# Altium schematic sheet EGT_V1.SchDoc
size B; PageSetup: Record=PageOptions|CenterHorizontal=True|CenterVertical=True|PrintScale=1.00|XCorrection=1.00|YCorrection=1.00|PrintKind=1|BorderSize=5000000|LeftOffset=0|BottomOffset=0|Orientation=2|PaperLength=1000|PaperWidth=1000|Scale=100|PaperSource=7|PrintQuality=-3|MediaType=1|DitherType=10|PrintScaleMode=1|PaperKind=Letter|PaperIndex=1
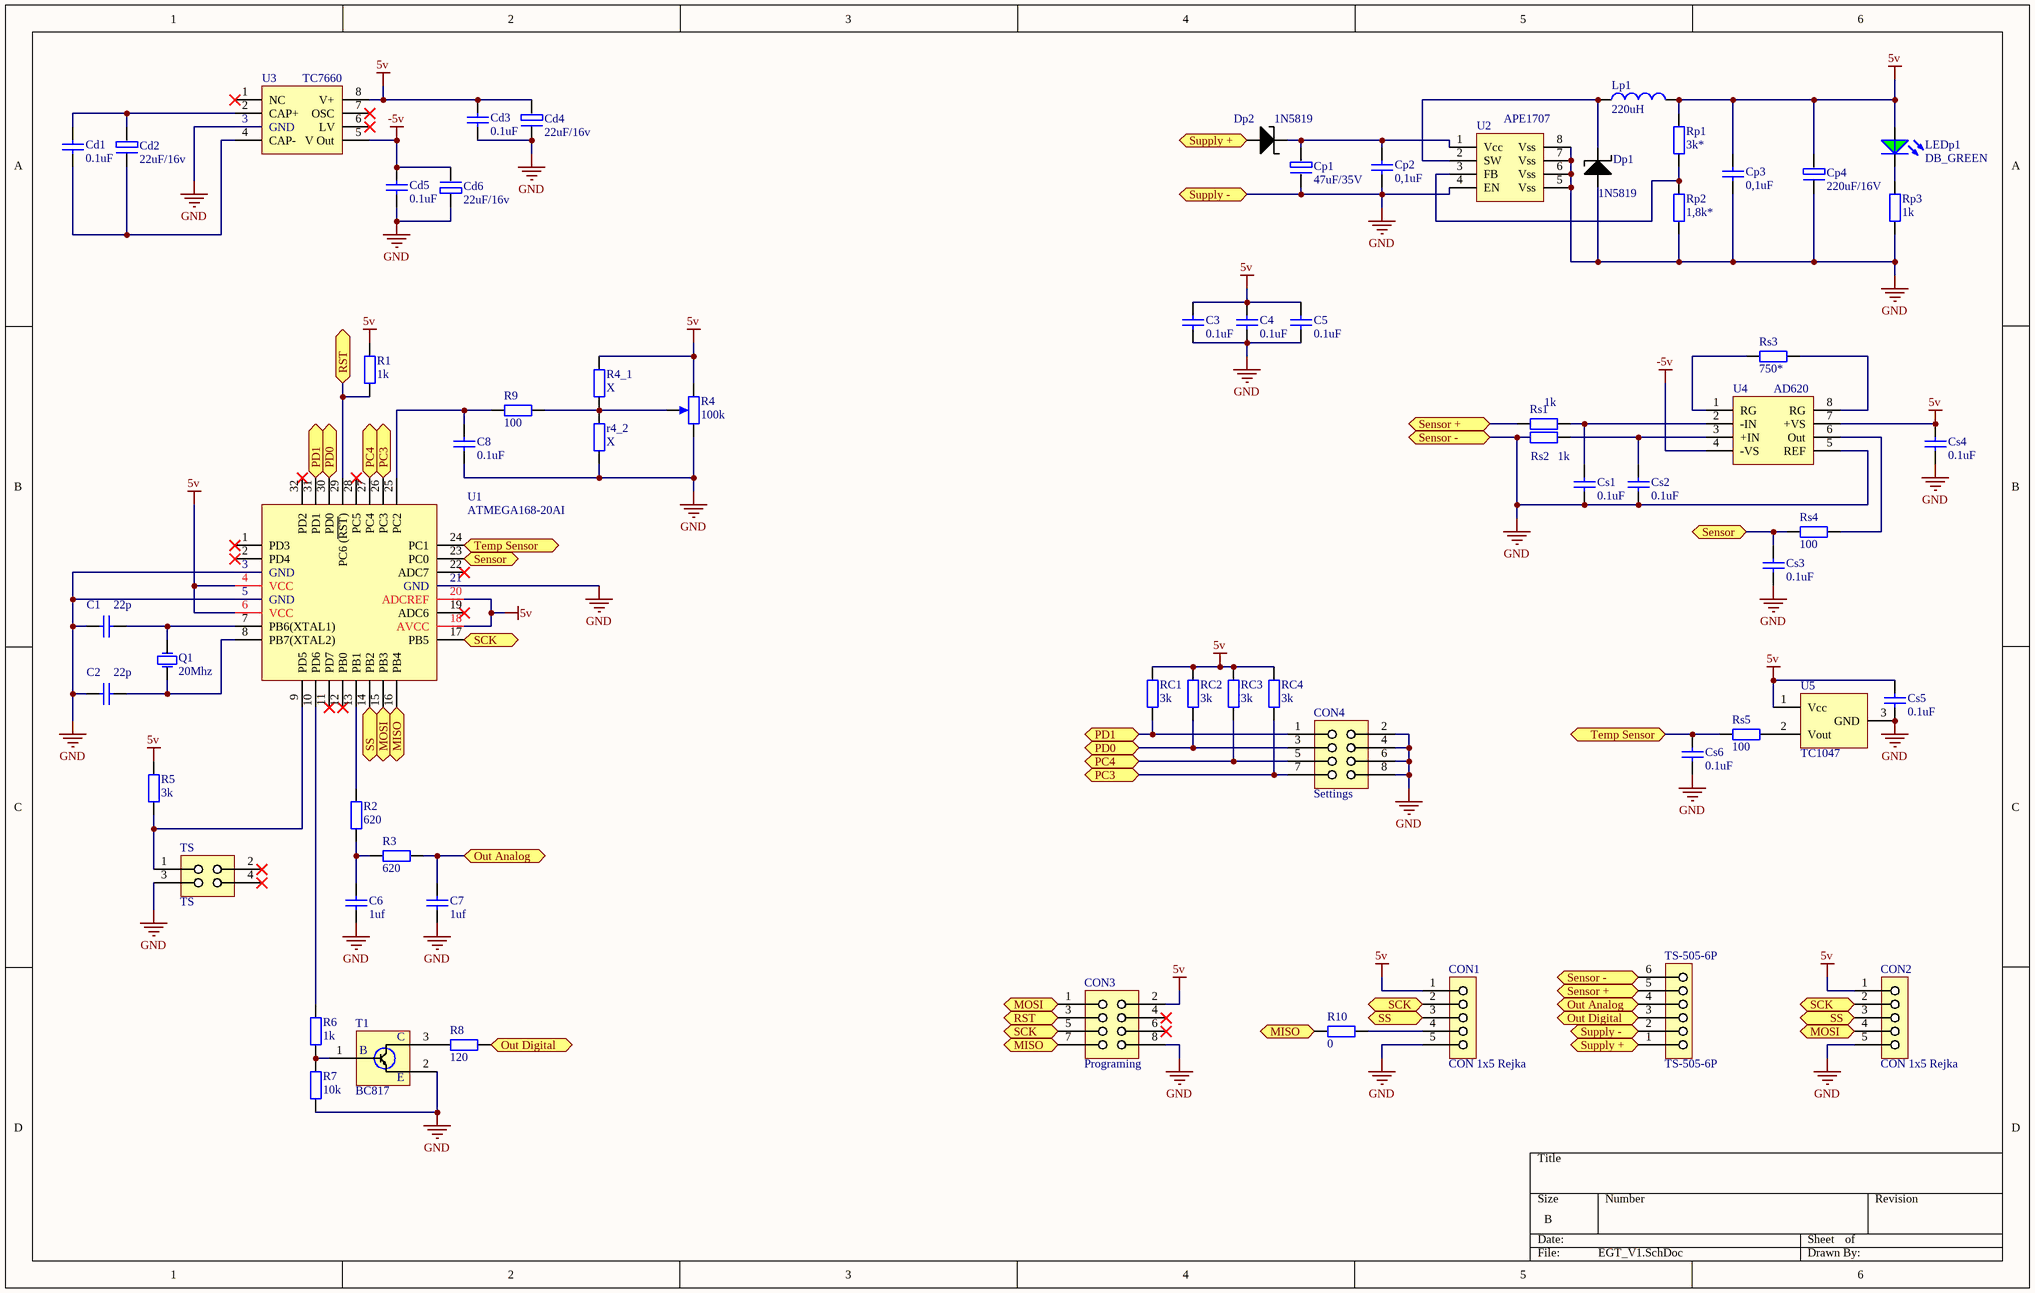
[diagram p0: EGT_V1.SchDoc]

## Parts
C1  22p  [C 0603]
C2  22p  [C 0603]
C3  0.1uF  [C 0603]
C4  0.1uF  [C 0603]
C5  0.1uF  [C 0603]
C6  1uf  [C 0603]
C7  1uf  [C 0603]
C8  0.1uF  [C 0603]
Cd1  0.1uF  [C 0603]
Cd2  22uF/16v  [CAPACITOR C 22uF]
Cd3  0.1uF  [C 0603]
Cd4  22uF/16v  [CAPACITOR C 22uF]
Cd5  0.1uF  [C 0603]
Cd6  22uF/16v  [CAPACITOR C 22uF]
CON1  CON 1x5 Rejka  [1x5 2.54]
CON2  CON 1x5 Rejka  [1x5 2.54]
CON3  Programing  [2x4 2mm]
CON4  Settings  [2x4 2mm]
Cp1  47uF/35V  [CAPACITOR D]
Cp2  0,1uF  [C 0603]
Cp3  0,1uF  [C 0603]
Cp4  220uF/16V  [CAPACITOR D]
Cs1  0.1uF  [C 0603]
Cs2  0.1uF  [C 0603]
Cs3  0.1uF  [C 0603]
Cs4  0.1uF  [C 0603]
Cs5  0.1uF  [C 0603]
Cs6  0.1uF  [C 0603]
Dp1  1N5819  [SMA]
Dp2  1N5819  [SMA]
LEDp1  DB_GREEN  [LED 0805 - GREEN]
Lp1  220uH  [INDUCTOR SD-75]
Q1  20Mhz  [Quartz]
R1  1k  [R 0603]
R2  620  [R 0603]
R3  620  [R 0603]
R4  100k  [Rpotenciometer]
R4_1  X  [R 0603]
r4_2  X  [R 0603]
R5  3k  [R 0603]
R6  1k  [R 0603]
R7  10k  [R 0603]
R8  120  [R 1206]
R9  100  [R 0603]
R10  0  [R 0603]
RC1  3k  [R 0603]
RC2  3k  [R 0603]
RC3  3k  [R 0603]
RC4  3k  [R 0603]
Rp1  3k*  [R 0603]
Rp2  1,8k*  [R 0603]
Rp3  1k  [R 0603]
Rs1  1k  [R 0603]
Rs2  1k  [R 0603]
Rs3  750*  [R 0603]
Rs4  100  [R 0603]
Rs5  100  [R 0603]
T1  BC817  [SOT-23]
TS  TS  [TS]
TS-505-6P  TS-505-6P  [TS-505-6P]
U1  ATMEGA168-20AI  [TQFP32]
U2  APE1707  [SOP-8]
U3  TC7660  [SOP-8]
U4  AD620  [SOP-8]
U5  TC1047  [SOT-23]

## Ports
MISO, MOSI, Out Analog, Out Digital, PC3, PC4, PD0, PD1, RST, SCK, Sensor, Sensor +, Sensor -, SS, Supply +, Supply -, Temp Sensor

## Nets
5v: C3.2 C4.2 C5.2 Cd3.2 Cd4.1 CON1.1 CON2.1 CON3.2 Cp3.2 Cp4.1 Cs4.2 Cs5.2 LEDp1.1(A) Lp1.2 R1.2 R4.2 R4_1.1 R5.1 RC1.1 RC2.1 RC3.1 RC4.1 Rp1.2 U1.4(VCC) U1.6(VCC) U1.18(AVCC) U1.20(ADCREF) U3.8(V+) U4.7(+VS) U5.1(Vcc)
-5v: Cd5.1 Cd6.2 U3.5(V_Out) U4.4(-VS)
GND: C1.1 C2.1 C3.1 C4.1 C5.1 C6.1 C7.1 C8.1 Cd3.1 Cd4.2 Cd5.2 Cd6.1 CON1.5 CON2.5 CON3.8 CON4.2 CON4.4 CON4.6 CON4.8 Cp1.2 Cp2.1 Cp3.1 Cp4.2 Cs1.1 Cs2.1 Cs3.1 Cs4.1 Cs5.1 Cs6.1 Dp1.1 R4.1 r4_2.2 R7.2 Rp2.1 Rp3.1 Rs2.2 T1.2(E) TS.3 TS-505-6P.2 TS-505-6P.6 U1.3(GND) U1.5(GND) U1.21(GND) U2.4(EN) U2.5(Vss) U2.6(Vss) U2.7(Vss) U2.8(Vss) U3.3(GND) U4.5(REF) U5.3(GND) ; port Supply -, port Sensor -
MISO: CON3.7 R10.2 U1.16(PB4) ; port MISO
MOSI: CON2.4 CON3.1 U1.15(PB3) ; port MOSI
Out Analog: C7.2 R3.1 TS-505-6P.4 ; port Out Analog
Out Digital: R8.2 TS-505-6P.3 ; port Out Digital
PC3: CON4.7 RC4.2 U1.26(PC3) ; port PC3
PC4: CON4.5 RC3.2 U1.27(PC4) ; port PC4
PD0: CON4.3 RC2.2 U1.30(PD0) ; port PD0
PD1: CON4.1 RC1.2 U1.31(PD1) ; port PD1
RST: CON3.3 R1.1 U1.29(PC6_(~{RST})) ; port RST
SCK: CON1.2 CON2.2 CON3.5 U1.17(PB5) ; port SCK
Sensor: Cs3.2 Rs4.2 U1.23(PC0) ; port Sensor
Sensor +: Rs1.2 TS-505-6P.5 ; port Sensor +
SS: CON1.3 CON2.3 U1.14(PB2) ; port SS
Supply +: Dp2.1 TS-505-6P.1 ; port Supply +
Temp Sensor: Cs6.2 Rs5.1 U1.24(PC1) ; port Temp Sensor
NetC1_2: C1.2 Q1.2(OSC2) U1.7(PB6(XTAL1))
NetC2_2: C2.2 Q1.1(OSC1) U1.8(PB7(XTAL2))
NetC6_2: C6.2 R2.1 R3.2
NetC8_2: C8.2 R9.2 U1.25(PC2)
NetCd1_1: Cd1.1 Cd2.2 U3.4(CAP-)
NetCd1_2: Cd1.2 Cd2.1 U3.2(CAP+)
NetCON1_4: CON1.4 R10.1
NetCp1_1: Cp1.1 Cp2.2 Dp2.2 U2.1(Vcc)
NetCs1_2: Cs1.2 Rs1.1 U4.2(-IN)
NetCs2_2: Cs2.2 Rs2.1 U4.3(+IN)
NetDp1_2: Dp1.2 Lp1.1 U2.2(SW)
NetLEDp1_2: LEDp1.2(K) Rp3.2
NetR2_2: R2.2 U1.13(PB1)
NetR4_3: R4.3 R4_1.2 r4_2.1 R9.1
NetR5_2: R5.2 TS.1 U1.9(PD5)
NetR6_1: R6.1 U1.10(PD6)
NetR6_2: R6.2 R7.1 T1.1(B)
NetR8_1: R8.1 T1.3(C)
NetRp1_1: Rp1.1 Rp2.2 U2.3(FB)
NetRs3_1: Rs3.1 U4.8(RG)
NetRs3_2: Rs3.2 U4.1(RG)
NetRs4_1: Rs4.1 U4.6(Out)
NetRs5_2: Rs5.2 U5.2(Vout)

Not connected (* = marked no-connect by the designer): CON3 4* 6*; TS 2* 4*; U1 1(PD3)* 2(PD4)* 11(PD7)* 12(PB0)* 19(ADC6)* 22(ADC7)* 28(PC5)* 32(PD2)*; U3 1(NC)* 6(LV)* 7(OSC)*

## Library data of the parts
C1-C8 Cd1 Cd3 Cd5 Cp2 Cp3 Cs1-Cs6 = C: CAPACITOR; Value: C
Cd2 Cd4 Cd6 Cp1 Cp4 = EC: CAPACITOR ELECTROLYTIC; Value: C
CON3 CON4 = CON 2x4
Dp1 Dp2 = SCHOTTKY DIODE: SMD; LatestRevisionDate: 17-Jul-2002; LatestRevisionNote: Re-released for DXP Platform.; Publisher: Altium Limited
LEDp1 = DB_GREEN: GREEN LED; Value: D
Lp1 = Inductor
Q1 = Quartz
R1-R3 R4_1 r4_2 R5-R10 RC1-RC4 Rp1-Rp3 Rs1-Rs5 = R: Value: R
R4 = RP: Value: R
TS = TS: Button
U1 = ATMEGA168-20AI: CPU ATMEGA168
U2 = APE1707: STEP-DOWN DC/DC CONVERTER
U3 = TC7660: DC/DC CONVERTER
U4 = AD620: Instrumental Amplifier
U5 = TC1047: Temperature-to-Voltage Converter